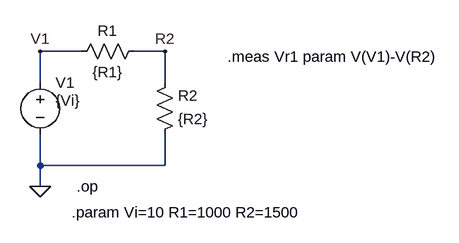
[diagram p0: schematic netfiletest.asc]
netfiletest.asc, the LTspice schematic file:
Version 4
SHEET 1 880 680
WIRE 128 -176 64 -176
WIRE 256 -176 208 -176
WIRE 64 -128 64 -176
WIRE 256 -128 256 -176
WIRE 64 0 64 -48
WIRE 256 0 256 -48
WIRE 256 0 64 0
WIRE 64 32 64 0
FLAG 64 32 0
FLAG 256 -176 R2
FLAG 64 -176 V1
SYMBOL res 224 -192 R90
WINDOW 0 0 56 VBottom 2
WINDOW 3 32 56 VTop 2
SYMATTR InstName R1
SYMATTR Value {R1}
SYMBOL res 240 -32 M180
WINDOW 0 36 76 Left 2
WINDOW 3 36 40 Left 2
SYMATTR InstName R2
SYMATTR Value {R2}
SYMBOL voltage 64 -144 R0
WINDOW 3 24 44 Left 2
WINDOW 123 0 0 Left 0
WINDOW 39 0 0 Left 0
SYMATTR Value {Vi}
SYMATTR InstName V1
TEXT 120 32 Left 2 !.op
TEXT 112 72 Left 2 !.param Vi=10 R1=1000 R2=1500
TEXT 352 -168 Left 2 !.meas Vr1 param V(V1)-V(R2)

The netlist it stands for:
* netfiletest.asc
R1 R2 V1 {R1}
R2 0 R2 {R2}
V1 V1 0 {Vi}
.op
.param Vi=10 R1=1000 R2=1500
.meas Vr1 param V(V1)-V(R2)
.backanno
.end